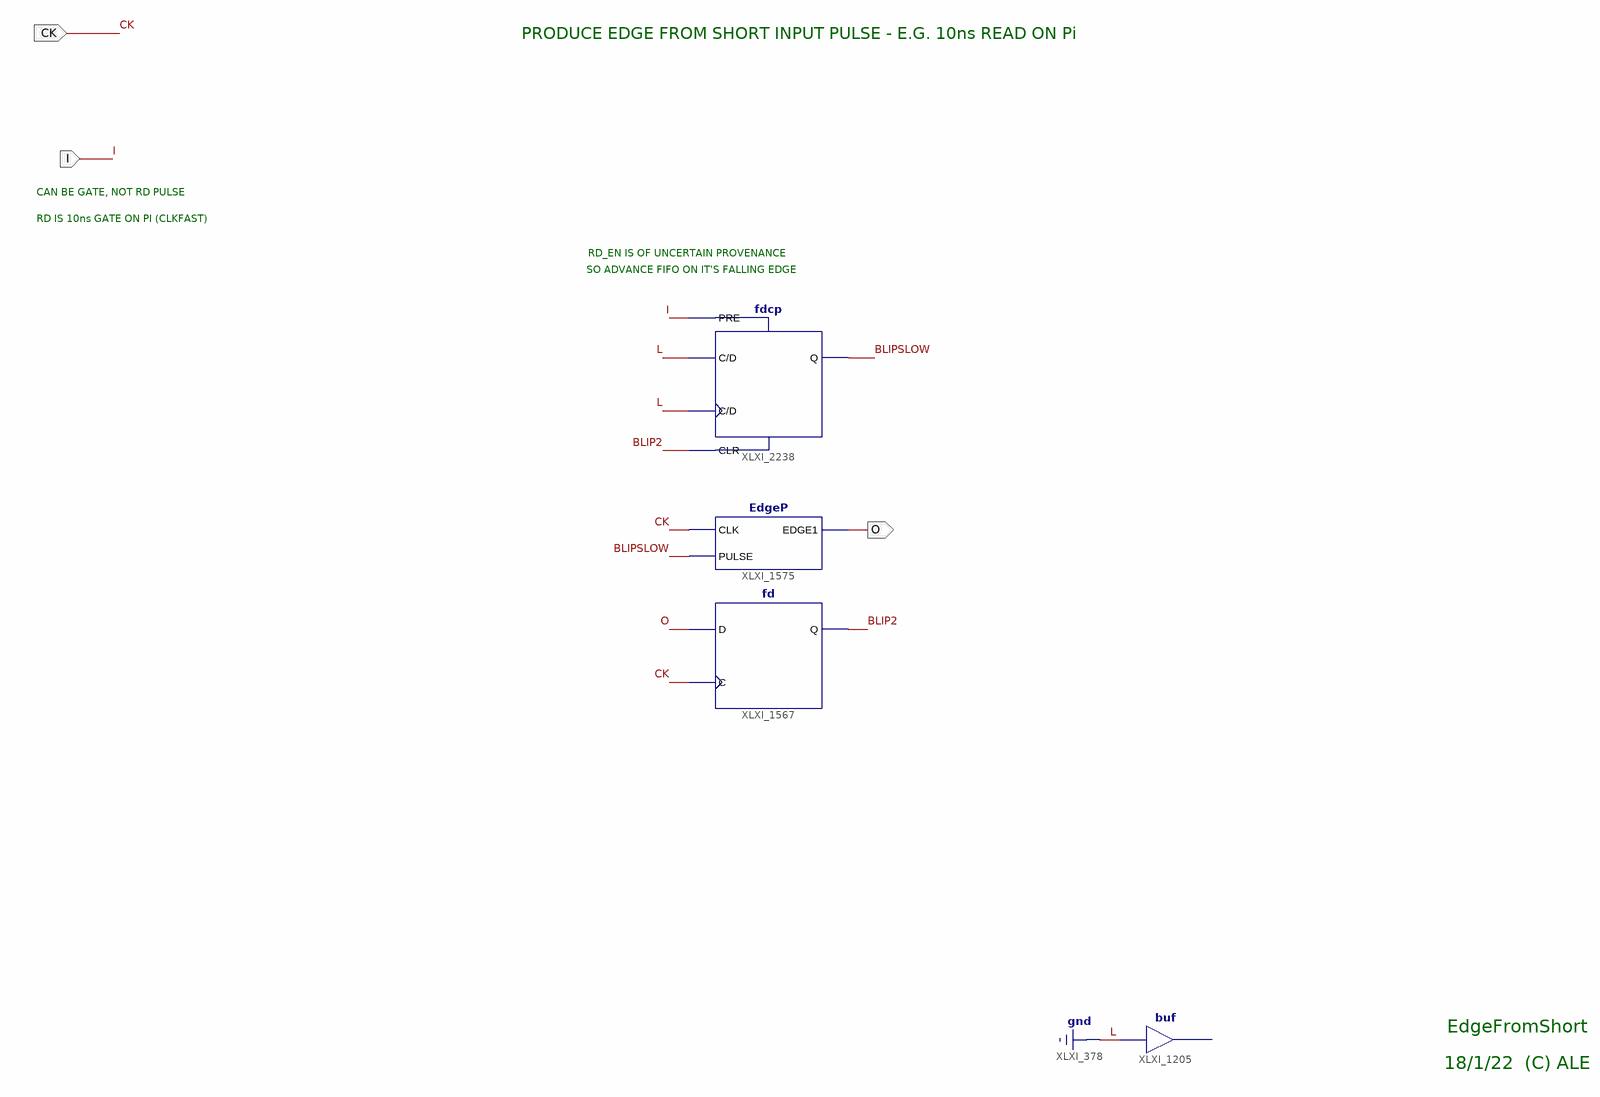
[diagram p0: schematic sheet 1]
// Xilinx ISE schematic EdgeFromShort.sch (spartan3e) as structural Verilog: 4 symbols, 3 ports
module EdgeFromShort (
  input  I,
  input  CK,
  output O
);

  wire BLIP2, BLIPSLOW;

  // buf XLXI_1205 has open pins: I=1'b0, O=open
  fd XLXI_1567 (.C(CK), .D(O), .Q(BLIP2));
  EdgeP XLXI_1575 (.CLK(CK), .EDGE1(O), .PULSE(BLIPSLOW));
  fdcp XLXI_2238 (.C(1'b0), .CLR(BLIP2), .D(1'b0), .PRE(I), .Q(BLIPSLOW));

  // Notes on the sheet:
  //   PRODUCE EDGE FROM SHORT INPUT PULSE - E.G. 10ns READ ON Pi
  //   CAN BE GATE, NOT RD PULSE
  //   RD IS 10ns GATE ON PI (CLKFAST)
  //   RD_EN IS OF UNCERTAIN PROVENANCE
  //   SO ADVANCE FIFO ON IT'S FALLING EDGE
  //   EdgeFromShort
  //   18/1/22  (C) ALE
endmodule
